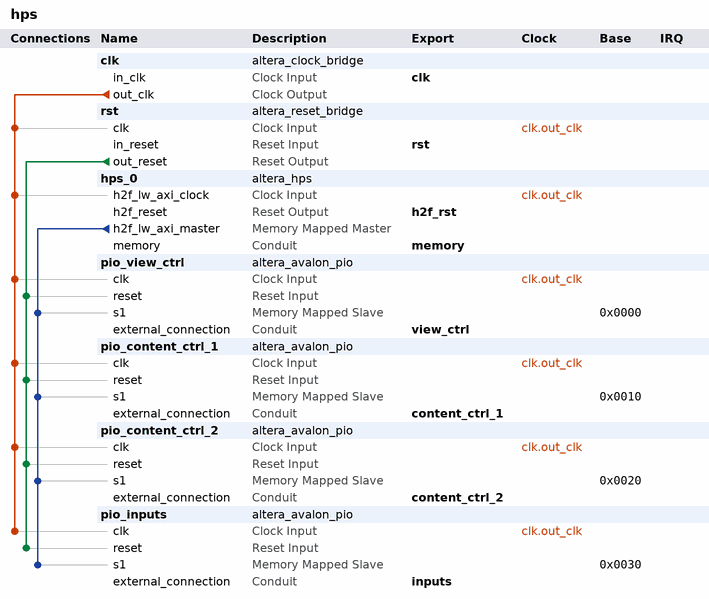
[diagram p0: system contents]
# Platform Designer (Qsys) system hps, Cyclone V 5CSEMA5F31C6
# Parameters at their usual value, and those the tool derives, are not listed.
package require -exact qsys 17.0
create_system hps
set_project_property DEVICE_FAMILY {Cyclone V}
set_project_property DEVICE 5CSEMA5F31C6

add_instance clk altera_clock_bridge 17.0
set_instance_parameter_value clk DERIVED_CLOCK_RATE 0
set_instance_parameter_value clk EXPLICIT_CLOCK_RATE 98000000

add_instance rst altera_reset_bridge 17.0
set_instance_parameter_value rst ACTIVE_LOW_RESET 0
set_instance_parameter_value rst SYNCHRONOUS_EDGES both

add_instance hps_0 altera_hps 17.0
set_instance_parameter_value hps_0 EMAC1_Mode N/A
set_instance_parameter_value hps_0 EMAC1_PinMuxing Unused
set_instance_parameter_value hps_0 F2SCLK_COLDRST_Enable false
set_instance_parameter_value hps_0 F2SCLK_DBGRST_Enable false
set_instance_parameter_value hps_0 F2SCLK_WARMRST_Enable false
set_instance_parameter_value hps_0 F2SINTERRUPT_Enable false
set_instance_parameter_value hps_0 F2S_Width 0
set_instance_parameter_value hps_0 FPGA_PERIPHERAL_OUTPUT_CLOCK_FREQ_EMAC0_GTX_CLK 125
set_instance_parameter_value hps_0 FPGA_PERIPHERAL_OUTPUT_CLOCK_FREQ_EMAC0_MD_CLK 2.5
set_instance_parameter_value hps_0 FPGA_PERIPHERAL_OUTPUT_CLOCK_FREQ_EMAC1_GTX_CLK 125
set_instance_parameter_value hps_0 FPGA_PERIPHERAL_OUTPUT_CLOCK_FREQ_EMAC1_MD_CLK 2.5
set_instance_parameter_value hps_0 HPS_PROTOCOL DDR3
set_instance_parameter_value hps_0 I2C0_Mode N/A
set_instance_parameter_value hps_0 I2C0_PinMuxing Unused
set_instance_parameter_value hps_0 I2C1_Mode N/A
set_instance_parameter_value hps_0 I2C1_PinMuxing Unused
set_instance_parameter_value hps_0 LWH2F_Enable true
set_instance_parameter_value hps_0 MEM_BANKADDR_WIDTH 3
set_instance_parameter_value hps_0 MEM_CLK_FREQ 400.0
set_instance_parameter_value hps_0 MEM_COL_ADDR_WIDTH 10
set_instance_parameter_value hps_0 MEM_DQ_WIDTH 32
set_instance_parameter_value hps_0 MEM_DRV_STR RZQ/7
set_instance_parameter_value hps_0 MEM_ROW_ADDR_WIDTH 15
set_instance_parameter_value hps_0 MEM_RTT_NOM RZQ/4
set_instance_parameter_value hps_0 MEM_RTT_WR RZQ/4
set_instance_parameter_value hps_0 MEM_TCL 11
set_instance_parameter_value hps_0 MEM_TFAW_NS 30.0
set_instance_parameter_value hps_0 MEM_TRAS_NS 35.0
set_instance_parameter_value hps_0 MEM_TRCD_NS 13.75
set_instance_parameter_value hps_0 MEM_TRFC_NS 260.0
set_instance_parameter_value hps_0 MEM_TRP_NS 13.75
set_instance_parameter_value hps_0 MEM_VENDOR JEDEC
set_instance_parameter_value hps_0 MEM_WTCL 8
set_instance_parameter_value hps_0 QSPI_Mode N/A
set_instance_parameter_value hps_0 QSPI_PinMuxing Unused
set_instance_parameter_value hps_0 REF_CLK_FREQ 25.0
set_instance_parameter_value hps_0 S2FCLK_USER2CLK 5
set_instance_parameter_value hps_0 S2F_Width 0
set_instance_parameter_value hps_0 SDIO_Mode N/A
set_instance_parameter_value hps_0 SDIO_PinMuxing Unused
set_instance_parameter_value hps_0 SPIM1_Mode N/A
set_instance_parameter_value hps_0 SPIM1_PinMuxing Unused
set_instance_parameter_value hps_0 STM_Enable false
set_instance_parameter_value hps_0 TIMING_BOARD_AC_SKEW 0.03
set_instance_parameter_value hps_0 TIMING_BOARD_AC_TO_CK_SKEW 0.0
set_instance_parameter_value hps_0 TIMING_BOARD_DQ_TO_DQS_SKEW 0.0
set_instance_parameter_value hps_0 TIMING_BOARD_MAX_CK_DELAY 0.03
set_instance_parameter_value hps_0 TIMING_BOARD_MAX_DQS_DELAY 0.02
set_instance_parameter_value hps_0 TIMING_BOARD_SKEW_BETWEEN_DQS 0.08
set_instance_parameter_value hps_0 TIMING_BOARD_SKEW_CKDQS_DIMM_MAX 0.16
set_instance_parameter_value hps_0 TIMING_BOARD_SKEW_CKDQS_DIMM_MIN 0.09
set_instance_parameter_value hps_0 TIMING_BOARD_SKEW_WITHIN_DQS 0.01
set_instance_parameter_value hps_0 TIMING_TDH 65
set_instance_parameter_value hps_0 TIMING_TDQSCK 255
set_instance_parameter_value hps_0 TIMING_TDQSQ 125
set_instance_parameter_value hps_0 TIMING_TDS 30
set_instance_parameter_value hps_0 TIMING_TIH 140
set_instance_parameter_value hps_0 TIMING_TIS 180
set_instance_parameter_value hps_0 TIMING_TQSH 0.4
set_instance_parameter_value hps_0 UART0_Mode N/A
set_instance_parameter_value hps_0 UART0_PinMuxing Unused
set_instance_parameter_value hps_0 USB1_Mode N/A
set_instance_parameter_value hps_0 USB1_PinMuxing Unused
set_instance_parameter_value hps_0 desired_cfg_clk_mhz 100.0
set_instance_parameter_value hps_0 desired_qspi_clk_mhz 400.0

add_instance pio_view_ctrl altera_avalon_pio 17.0
set_instance_parameter_value pio_view_ctrl direction Output
set_instance_parameter_value pio_view_ctrl width 32

add_instance pio_content_ctrl_1 altera_avalon_pio 17.0
set_instance_parameter_value pio_content_ctrl_1 direction Output
set_instance_parameter_value pio_content_ctrl_1 width 32

add_instance pio_content_ctrl_2 altera_avalon_pio 17.0
set_instance_parameter_value pio_content_ctrl_2 direction Output
set_instance_parameter_value pio_content_ctrl_2 width 32

add_instance pio_inputs altera_avalon_pio 17.0
set_instance_parameter_value pio_inputs captureEdge true
set_instance_parameter_value pio_inputs direction Input
set_instance_parameter_value pio_inputs width 32

# connections
add_connection clk.out_clk hps_0.h2f_lw_axi_clock clock
add_connection clk.out_clk pio_content_ctrl_1.clk clock
add_connection clk.out_clk pio_content_ctrl_2.clk clock
add_connection clk.out_clk pio_inputs.clk clock
add_connection clk.out_clk pio_view_ctrl.clk clock
add_connection clk.out_clk rst.clk clock
add_connection rst.out_reset pio_content_ctrl_1.reset reset
add_connection rst.out_reset pio_content_ctrl_2.reset reset
add_connection rst.out_reset pio_inputs.reset reset
add_connection rst.out_reset pio_view_ctrl.reset reset
add_connection hps_0.h2f_lw_axi_master pio_content_ctrl_1.s1 avalon
set_connection_parameter_value hps_0.h2f_lw_axi_master/pio_content_ctrl_1.s1 baseAddress 0x0010
add_connection hps_0.h2f_lw_axi_master pio_content_ctrl_2.s1 avalon
set_connection_parameter_value hps_0.h2f_lw_axi_master/pio_content_ctrl_2.s1 baseAddress 0x0020
add_connection hps_0.h2f_lw_axi_master pio_inputs.s1 avalon
set_connection_parameter_value hps_0.h2f_lw_axi_master/pio_inputs.s1 baseAddress 0x0030
add_connection hps_0.h2f_lw_axi_master pio_view_ctrl.s1 avalon
set_connection_parameter_value hps_0.h2f_lw_axi_master/pio_view_ctrl.s1 baseAddress 0x0000

# exported interfaces
add_interface clk clock sink
set_interface_property clk EXPORT_OF clk.in_clk
add_interface content_ctrl_1 conduit end
set_interface_property content_ctrl_1 EXPORT_OF pio_content_ctrl_1.external_connection
add_interface content_ctrl_2 conduit end
set_interface_property content_ctrl_2 EXPORT_OF pio_content_ctrl_2.external_connection
add_interface h2f_rst reset source
set_interface_property h2f_rst EXPORT_OF hps_0.h2f_reset
add_interface inputs conduit end
set_interface_property inputs EXPORT_OF pio_inputs.external_connection
add_interface memory conduit end
set_interface_property memory EXPORT_OF hps_0.memory
add_interface rst reset sink
set_interface_property rst EXPORT_OF rst.in_reset
add_interface view_ctrl conduit end
set_interface_property view_ctrl EXPORT_OF pio_view_ctrl.external_connection

set_interconnect_requirement {$system} qsys_mm.clockCrossingAdapter HANDSHAKE
set_interconnect_requirement {$system} qsys_mm.enableEccProtection FALSE
set_interconnect_requirement {$system} qsys_mm.insertDefaultSlave FALSE
set_interconnect_requirement {$system} qsys_mm.maxAdditionalLatency 1

save_system hps.qsys
